# EAGLE design FPGA (EAGLE 9.1.0)
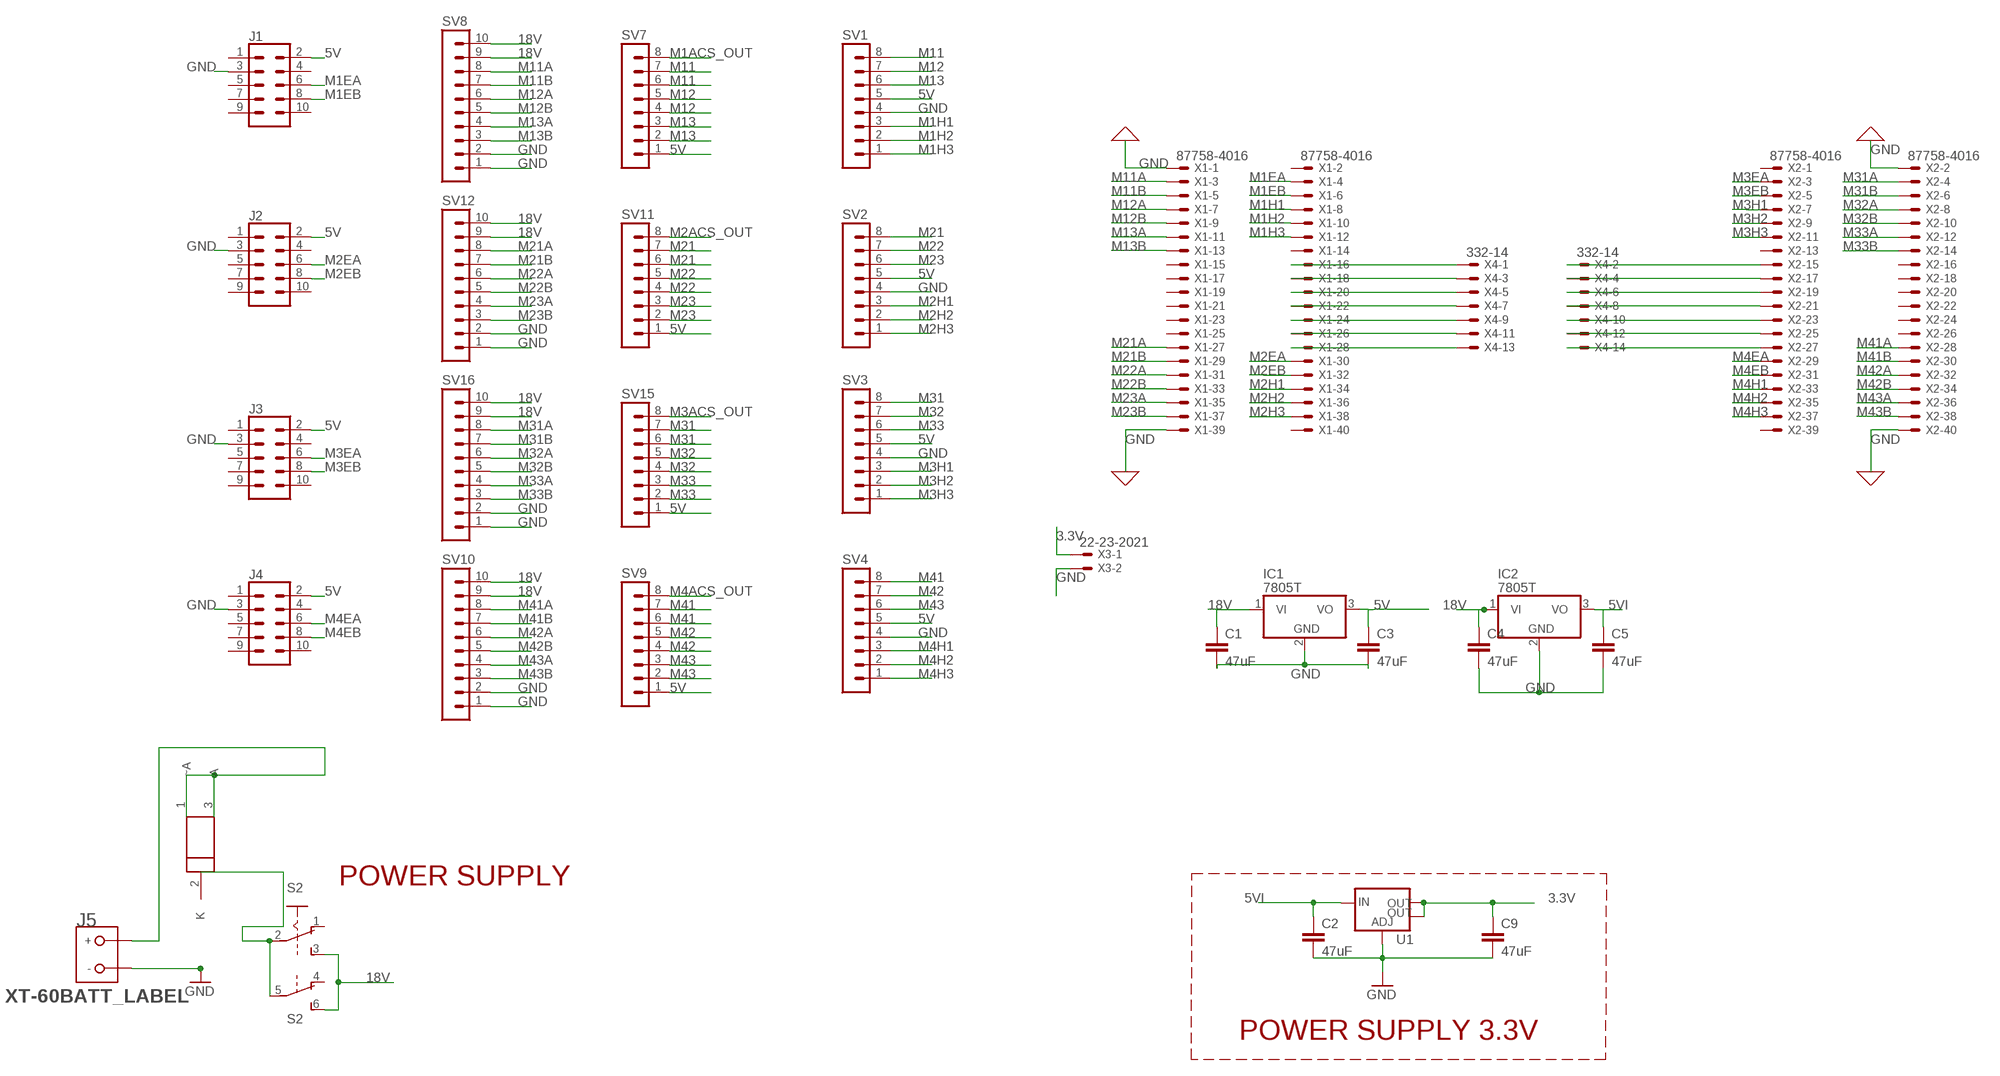
[diagram p0: schematic, sheet 1]

## Parts
C1  47uF  C-EUC1206  [C1206]
C2  47uF  C-EUC1206  [C1206]
C3  47uF  C-EUC1206  [C1206]
C4  47uF  C-EUC1206  [C1206]
C5  47uF  C-EUC1206  [C1206]
C9  47uF  C-EUC1206  [C1206]
IC1  7805T  [TO220H]
IC2  7805T  [TO220H]
J1  CONN_05X2SHD_LOCK  [2X5-SHROUDED_LOCK]
J2  CONN_05X2SHD_LOCK  [2X5-SHROUDED_LOCK]
J3  CONN_05X2SHD_LOCK  [2X5-SHROUDED_LOCK]
J4  CONN_05X2SHD_LOCK  [2X5-SHROUDED_LOCK]
J5  XT-60BATT_LABEL  [XT-60]
S2  A68-A31  [A68-A31]
SV1  MA08-1  [MA08-1]
SV2  MA08-1  [MA08-1]
SV3  MA08-1  [MA08-1]
SV4  MA08-1  [MA08-1]
SV7  MA08-1  [MA08-1]
SV8  MA10-1  [MA10-1]
SV9  MA08-1  [MA08-1]
SV10  MA10-1  [MA10-1]
SV11  MA08-1  [MA08-1]
SV12  MA10-1  [MA10-1]
SV15  MA08-1  [MA08-1]
SV16  MA10-1  [MA10-1]
U1  V_REG_LM1117SOT223  [SOT223]
U3  LP38690DT-3.3  [TO228P1042X238-3N]
X1  87758-4016  [87758-4016]
X2  87758-4016  [87758-4016]
X3  22-23-2021  [22-23-2021]
X4  332-14  [332-14]

## Nets
3.3V [5v]: C9.1 U1.2(OUT) U1.4(OUT) X3.1
5V [5v]: C3.1 IC1.3(VO) J1.2 J2.2 J3.2 J4.2 SV1.5 SV2.5 SV3.5 SV4.5 SV7.1 SV9.1 SV11.1 SV15.1
5VI [5v]: C2.1 C5.1 IC2.3(VO) U1.3(IN)
18V [18V]: C1.1 C4.1 IC1.1(VI) IC2.1(VI) S2.3(A:S) S2.6(B:S) SV8.9 SV8.10 SV10.9 SV10.10 SV12.9 SV12.10 SV16.9 SV16.10
GND [gnd]: C1.2 C2.2 C3.2 C4.2 C5.2 C9.2 IC1.2(GND) IC2.2(GND) J1.3 J2.3 J3.3 J4.3 J5.GND(-) SV1.4 SV2.4 SV3.4 SV4.4 SV8.1 SV8.2 SV10.1 SV10.2 SV12.1 SV12.2 SV16.1 SV16.2 U1.1(ADJ) X1.1 X1.39 X2.2 X2.40 X3.2
INPUT [VCKT]: J5.BATT(+) U3.1(~A) U3.3(A)
M1ACS_OUT: SV7.8
M1EA: J1.6 X1.4
M1EB: J1.8 X1.6
M1H1: SV1.3 X1.8
M1H2: SV1.2 X1.10
M1H3: SV1.1 X1.12
M2ACS_OUT: SV11.8
M2EA: J2.6 X1.30
M2EB: J2.8 X1.32
M2H1: SV2.3 X1.34
M2H2: SV2.2 X1.36
M2H3: SV2.1 X1.38
M3ACS_OUT: SV15.8
M3EA: J3.6 X2.3
M3EB: J3.8 X2.5
M3H1: SV3.3 X2.7
M3H2: SV3.2 X2.9
M3H3: SV3.1 X2.11
M4ACS_OUT: SV9.8
M4EA: J4.6 X2.29
M4EB: J4.8 X2.31
M4H1: SV4.3 X2.33
M4H2: SV4.2 X2.35
M4H3: SV4.1 X2.37
M11: SV1.8 SV7.6 SV7.7
M11A [signal]: SV8.8 X1.3
M11B [signal]: SV8.7 X1.5
M12: SV1.7 SV7.4 SV7.5
M12A: SV8.6 X1.7
M12B: SV8.5 X1.9
M13: SV1.6 SV7.2 SV7.3
M13A: SV8.4 X1.11
M13B: SV8.3 X1.13
M21: SV2.8 SV11.6 SV11.7
M21A: SV12.8 X1.27
M21B: SV12.7 X1.29
M22: SV2.7 SV11.4 SV11.5
M22A: SV12.6 X1.31
M22B: SV12.5 X1.33
M23: SV2.6 SV11.2 SV11.3
M23A: SV12.4 X1.35
M23B: SV12.3 X1.37
M31 [motor]: SV3.8 SV15.6 SV15.7
M31A: SV16.8 X2.4
M31B: SV16.7 X2.6
M32 [motor]: SV3.7 SV15.4 SV15.5
M32A: SV16.6 X2.8
M32B: SV16.5 X2.10
M33 [motor]: SV3.6 SV15.2 SV15.3
M33A: SV16.4 X2.12
M33B: SV16.3 X2.14
M41: SV4.8 SV9.6 SV9.7
M41A: SV10.8 X2.28
M41B: SV10.7 X2.30
M42: SV4.7 SV9.4 SV9.5
M42A: SV10.6 X2.32
M42B: SV10.5 X2.34
M43: SV4.6 SV9.2 SV9.3
M43A: SV10.4 X2.36
M43B: SV10.3 X2.38
N$1: X1.16 X4.1
N$2: X1.18 X4.3
N$3: X1.20 X4.5
N$4: X1.22 X4.7
N$5: X1.24 X4.9
N$6: X1.26 X4.11
N$7: X1.28 X4.13
N$8: X2.27 X4.14
N$9: X2.25 X4.12
N$10: X2.23 X4.10
N$11: X2.21 X4.8
N$12: X2.19 X4.6
N$13: X2.17 X4.4
N$14: X2.15 X4.2
N$25 [default]: S2.2(A:P) S2.5(B:P) U3.2(K)
Unconnected: J1.1 J1.4 J1.5 J1.7 J1.9 J1.10 J2.1 J2.4 J2.5 J2.7 J2.9 J2.10 J3.1 J3.4 J3.5 J3.7 J3.9 J3.10 J4.1 J4.4 J4.5 J4.7 J4.9 J4.10 S2.1(A:O) S2.4(B:O) X1.2 X1.14 X1.15 X1.17 X1.19 X1.21 X1.23 X1.25 X1.40 X2.1 X2.13 X2.16 X2.18 X2.20 X2.22 X2.24 X2.26 X2.39

## Notes on the sheet
- POWER SUPPLY
- POWER SUPPLY 3.3V

## Library data of the parts
C1-C5 C9 = rcl:C-EU: CAPACITOR, European symbol
IC1 IC2 = linear:78*: Positive VOLTAGE REGULATOR Source: http://cache.national.com/ds/LM/LM78L05.pdf http://www.fairchildsemi.com/ds/LM/LM7805.pdf
J1-J4 = SparkFun-Connectors:CONN_05X2: Multi connection point. Often used as Generic Header-pin footprint for 0.1 inch spaced/style header connections For AVR SPI programming port, see special device with nice symbol: "AVR_SPI_PROG_5x2.dev" You can populate with any combo of single row headers, but if you'd like an exact match, check these: 2x5 AVR ICSP Male Header <https://www.sparkfun.com/products/778> (PRT-00778) 2x5 Pin Shrouded Header <https://www.sparkfun.com/products/8506> (PRT-08506) On any of the 0.1 inch spaced packages, you can populate with these: Break Away Headers - Straight <https://www.sparkfun.com/products/116> (PRT-00116) Break Away Male Headers - Right Angle <https://www.sparkfun.com/products/553> (PRT-00553) Female Headers <https://www.sparkfun.com/products/115> (PRT-00115) Break Away Headers - Machine Pin <https://www.sparkfun.com/products/117> (PRT-00117) Break Away Female Headers - Swiss Machine Pin <https://www.sparkfun.com/products/743> (PRT-00743) Special note: the shrouded connector mates well with our 5x2 ribbon cables: 2x5 Pin IDC Ribbon Cable <https://www.sparkfun.com/products/8535> (PRT-08535); PROD_ID: CONN-08671; SF_ID: PRT-08506
J5 = RoboJackets-Connectors:XT-60: XT-60 Power Connector Distributor: HobbyKing <http://www.hobbyking.com/hobbyking/store/RC_PRODUCT_SEARCH.asp?strSearch=xt-60>
S2 = switch:A68-A31: SLIDING SWITCH Siemens, distributor Buerklin, 11G766
SV1-SV4 SV7 SV9 SV11 SV15 = con-lstb:MA08-1: PIN HEADER; OC_FARNELL: unknown; OC_NEWARK: unknown
SV8 SV10 SV12 SV16 = con-lstb:MA10-1: PIN HEADER; OC_FARNELL: unknown; OC_NEWARK: unknown
U1 = SparkFun-PowerIC:V_REG_LM1117: Voltage Regulator LM1117 Standard adjustable voltage regulator but in SMD form. Spark Fun Electronics SKU : COM-00595; PROD_ID: VREG-08170
U3 = LP38690DT-3.3:LP38690DT-3.3; MPN: LP38690DT-3.3; OC_FARNELL: 1008048; OC_NEWARK: 41K7439; PACKAGE: TO-252; SUPPLIER: National Semiconductor
X1 X2 = con-molex:87758-4016: 40 Pin - 2mm Dual Row Single Wafer, Vertical T/H HDR Source: http://www.molex.com/pdm_docs/sd/877580616_sd.pdf; MF: MOLEX; MPN: 87758-4016; OC_FARNELL: unknown; OC_NEWARK: 25M5691
X3 = con-molex:22-23-2021: .100" (2.54mm) Center Header - 2 Pin; MF: MOLEX; MPN: 22-23-2021; OC_FARNELL: 1462926; OC_NEWARK: 25C3832
X4 = con-garry:332-14: 14 Pin - 2mm Dual Row Source: www.mpe-connector.de / garry_shortform_2012.pdf

## Net classes
0 signal1: width 0.3 mm, drill 0.4 mm, clearance 0.2 mm
1 5v: width 0.4 mm, drill 0.4 mm, clearance 0.2 mm
2 18V: width 1.2 mm, drill 1.3 mm, clearance 0.2 mm
3 signal: width 0.3 mm, drill 0.4 mm, clearance 0.2 mm
4 gnd: width 0.3 mm, drill 0.4 mm, clearance 0.2 mm
5 VCKT: width 4 mm, drill 4 mm, clearance 0.2 mm
6 motor: width 0.8 mm, drill 1 mm, clearance 0.2 mm

## Board
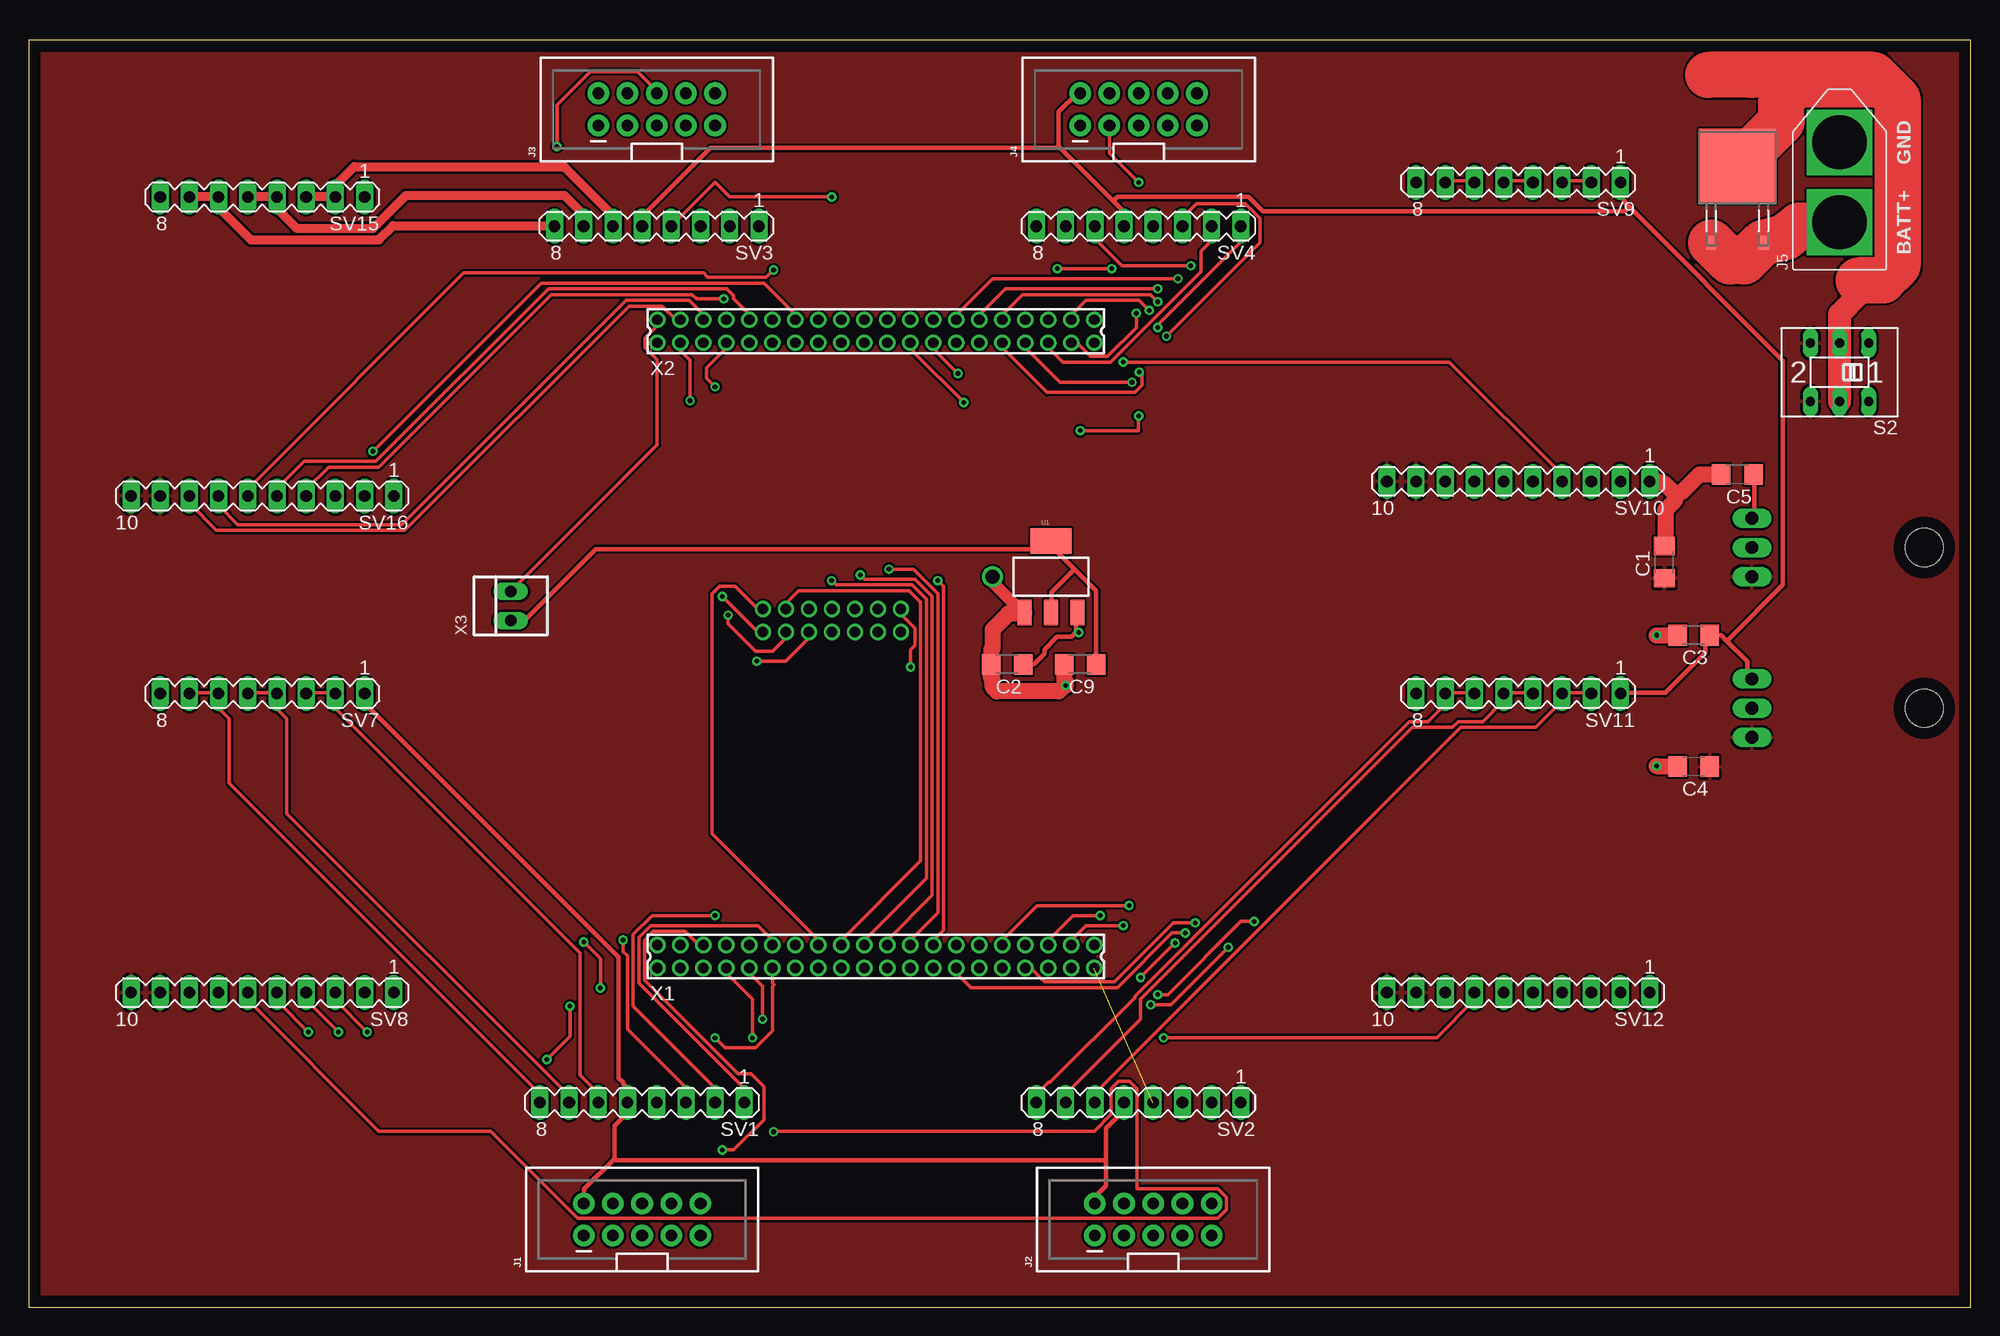
[diagram p1: board, top side]
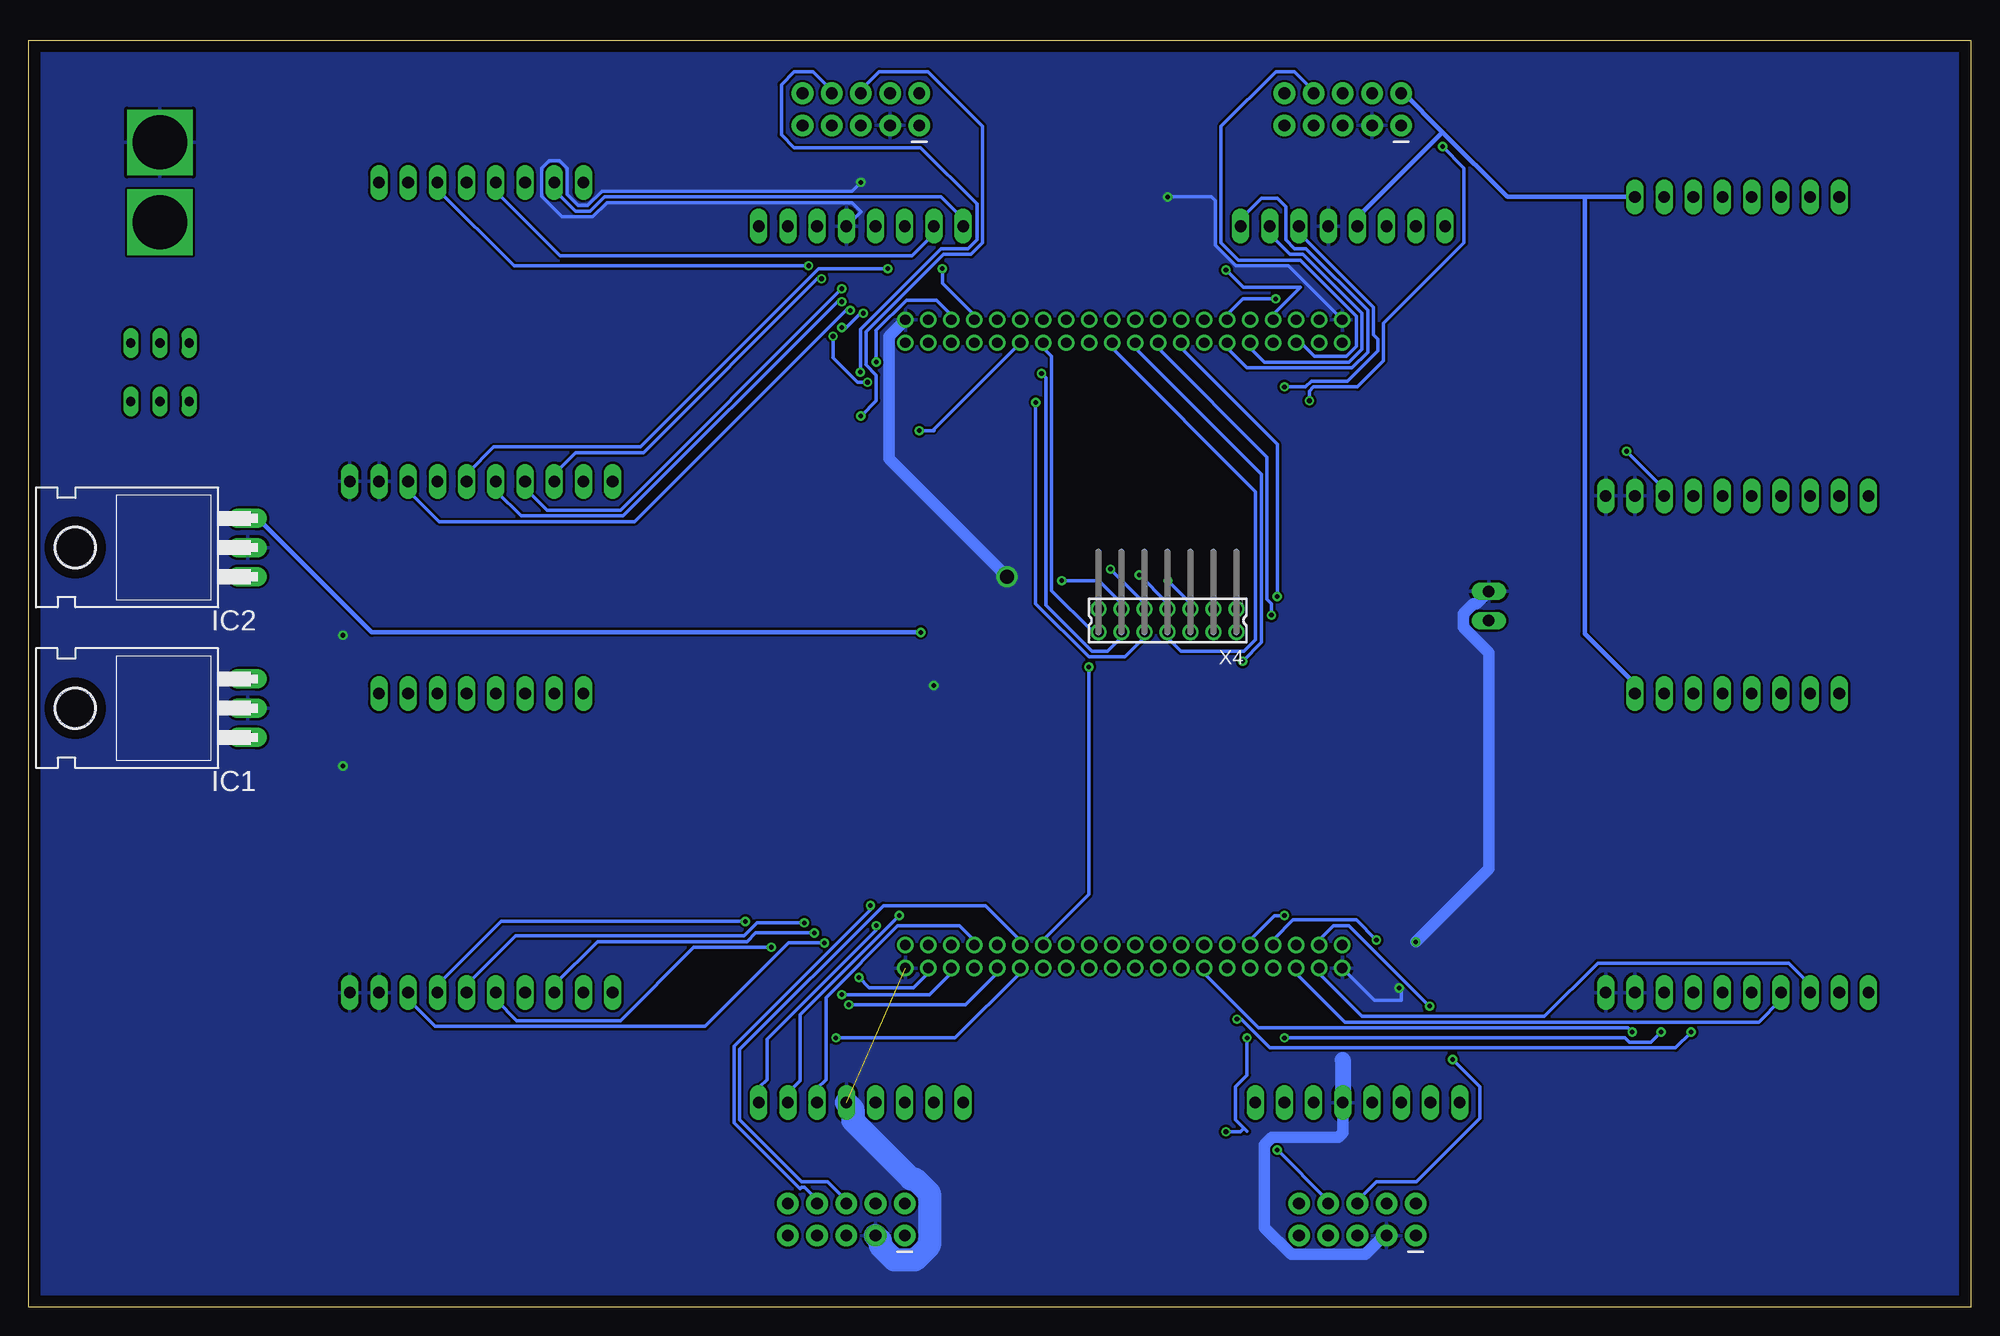
[diagram p2: board, bottom side, seen from below]

Size 168.89 x 110.16 mm. Coordinates in mm from the lower left corner, seen from the top.
Outline: 0,0 168.89,0 168.89,110.16 0,110.16 0,0
Copper layers (1*16): Top 0.035mm / dielectric 1.5mm / Bottom 0.035mm
Design rules "default": minimum track width 6mil, minimum drill 0.35mm, track to track 6mil, track to pad 6mil, pad to pad 6mil, via to via 6mil, smd to smd 6mil, copper to edge 40mil, drill to drill 6mil, minimum pad ring 10mil, minimum via ring 8mil, stop-mask expansion 4mil, vias tented up to drill 0mil, thermal gap 10mil

### Footprints (pad centres in the part's own frame; a part is rotated, then mirrored left to right if it is on the bottom)
C1206 = smd 1.6 x 1.8: 1 -1.4,0; 2 1.4,0
TO220H = drill 1.118 long: 1 -2.54,-10.16; 2 0,-10.16; 3 2.54,-10.16 | hole 3.302: 0,4.826
2X5-SHROUDED_LOCK = drill 1.016 pad 1.88: 1 -1.397,5.08; 2 1.397,5.08; 3 -1.397,2.54; 4 1.397,2.54; 5 -1.397,0; 6 1.397,0; 7 -1.397,-2.54; 8 1.397,-2.54; 9 -1.397,-5.08; 10 1.397,-5.08
XT-60 = drill 4.7 square: BATT 0,4.154; GND 0,11.092
A68-A31 = drill 0.813 long: 1 -2.54,-2.54; 2 0,-2.54; 3 2.54,-2.54; 4 -2.54,2.54; 5 0,2.54; 6 2.54,2.54
MA08-1 = drill 1.016 long: 1 -8.89,0; 2 -6.35,0; 3 -3.81,0; 4 -1.27,0; 5 1.27,0; 6 3.81,0; 7 6.35,0; 8 8.89,0
MA10-1 = drill 1.016 long: 1 -11.43,0; 2 -8.89,0; 3 -6.35,0; 4 -3.81,0; 5 -1.27,0; 6 1.27,0; 7 3.81,0; 8 6.35,0; 9 8.89,0; 10 11.43,0
SOT223 = smd 1.219 x 2.235: 1 -2.311,-3.099; 2 0,-3.099; 3 2.311,-3.099 | smd 3.6 x 2.2: 4 0,3.099
TO228P1042X238-3N = smd 0.889 x 1.219: 1 -2.286,-6.502; 3 2.286,-6.502 | smd 6.731 x 6.502: 2 0,0.152
87758-4016 = drill 0.9 pad 1.27: 1 -19,-1; 2 -19,1; 3 -17,-1; 4 -17,1; 5 -15,-1; 6 -15,1; 7 -13,-1; 8 -13,1; 9 -11,-1; 10 -11,1; 11 -9,-1; 12 -9,1; 13 -7,-1; 14 -7,1; 15 -5,-1; 16 -5,1; 17 -3,-1; 18 -3,1; 19 -1,-1; 20 -1,1; 21 1,-1; 22 1,1; 23 3,-1; 24 3,1; 25 5,-1; 26 5,1; 27 7,-1; 28 7,1; 29 9,-1; 30 9,1; 31 11,-1; 32 11,1; 33 13,-1; 34 13,1; 35 15,-1; 36 15,1; 37 17,-1; 38 17,1; 39 19,-1; 40 19,1
22-23-2021 = drill 1 long: 1 -1.27,0; 2 1.27,0
332-14 = drill 0.9 pad 1.27: 1 -6,-1; 2 -6,1; 3 -4,-1; 4 -4,1; 5 -2,-1; 6 -2,1; 7 0,-1; 8 0,1; 9 2,-1; 10 2,1; 11 4,-1; 12 4,1; 13 6,-1; 14 6,1

### Placement (x,y rotation side)
C1  142.24,64.77 90 top
C2  85.09,55.88 180 top
C3  144.78,58.42 180 top
C4  144.78,46.99 180 top
C5  148.59,72.39 180 top
C9  91.44,55.88 180 top
IC1  160.02,52.07 90 bottom
IC2  160.02,66.04 90 bottom
J1  53.34,7.62 90 top
J2  97.79,7.62 90 top
J3  54.61,104.14 90 top
J4  96.52,104.14 90 top
J5  157.48,90.17 0 top
S2  157.48,81.28 180 top
SV1  53.34,17.78 180 top
SV2  96.52,17.78 180 top
SV3  54.61,93.98 180 top
SV4  96.52,93.98 180 top
SV7  20.32,53.34 180 top
SV8  20.32,27.34 180 top
SV9  129.54,97.79 180 top
SV10  129.54,71.79 180 top
SV11  129.54,53.34 180 top
SV12  129.54,27.34 180 top
SV15  20.32,96.52 180 top
SV16  20.32,70.52 180 top
U1  88.9,63.5 0 top
U3  148.59,99.06 0 top
X1  73.66,30.48 0 top
X2  73.66,84.84 0 top
X3  41.91,60.96 90 top
X4  69.85,59.69 180 bottom

### Tracks (layer width: path | path; a pad name or v marks a point on that pad's centre or on a via)
3.3V
  Top 0.4: 90.94,64.16 88.94,66.16 88.94,66.53 U1.4 88.94,65.91 49.31,65.91 43.19,59.78 41.94,59.78 X3.1 | 90.94,64.16 92.81,62.28 92.81,55.91 C9.1 | U1.2 88.94,60.41 88.94,62.16 90.81,64.03 90.94,64.16
5V
  Top 0.4: 93.69,12.79 93.69,10.54 92.81,9.66 92.81,9.04 J2.2 | 93.69,12.79 93.69,15.54 95.19,17.04 95.19,17.66 SV2.5 | SV7.1 29.32,53.28 29.32,52.41 51.31,30.41 51.31,19.91 51.69,19.54 51.69,19.41 52.06,19.04 SV1.5 51.94,17.66 51.94,16.79 50.94,15.79 50.94,12.91 | 50.94,12.91 48.31,10.29 48.31,9.04 J1.2 | 93.69,12.79 93.56,12.79 51.06,12.79 50.94,12.91 | 147.69,57.91 149.44,56.16 149.44,55.03 149.81,54.66 IC1.3 | 147.69,57.91 147.19,58.41 C3.1 146.06,58.28 145.81,58.03 145.81,56.91 142.31,53.41 138.44,53.41 SV11.1 | 139.19,95.66 152.56,82.28 152.56,62.78 147.81,58.03 147.69,57.91 | 139.19,95.66 138.81,96.03 138.81,96.16 138.44,96.53 SV9.1 | 89.56,100.91 94.31,96.16 | 94.31,96.16 95.19,95.28 95.19,94.03 SV4.5 | 89.56,100.91 89.56,103.91 91.19,105.53 J4.2 | 89.56,100.91 89.44,100.78 59.31,100.78 53.44,94.91 53.44,94.03 SV3.5 | 139.19,95.66 139.06,95.53 138.81,95.28 107.31,95.28 106.06,96.53 94.69,96.53 94.44,96.28 94.31,96.16
  Bottom 0.4: 33.56,96.53 40.31,96.53 45.94,102.16 | 33.56,96.53 29.32,96.53 SV15.1 | 45.94,102.16 49.44,105.66 J3.2 | SV3.5 53.31,94.03 53.31,94.78 46.06,102.03 45.94,102.16 | SV7.1 29.32,53.41 29.32,54.28 33.56,58.53 33.56,96.41 33.56,96.53
5VI  (via drill 0.4)
  Top 0.4: C5.1 150.06,72.28 150.06,68.78 149.94,68.66 IC2.3 | 91.06,58.66 90.69,58.28 89.44,58.28 88.31,57.16 88.31,56.78 87.44,55.91 86.56,55.91 C2.1 | 91.06,58.66 91.06,60.16 91.19,60.28 U1.3 | v91.31,58.66 91.19,58.66 91.06,58.66
  Bottom 0.4: v91.31,58.66 139.06,58.66 148.94,68.53 149.81,68.53 IC2.3
18V
  pour Top (rank 2): -22.86,135.89 -22.86,3.81 0,-19.05 173.99,-19.05 187.96,-5.08 187.96,137.16 182.88,142.24 -16.51,142.24
GND  (via drill 0.4, 1.2)  (1 unrouted)
  Top 0.3: X3.2 54.66,74.98 54.66,82.35 53.61,83.4 53.61,84.28 54.66,85.33 X2.2 | v69.85,96.52 60.96,96.52 59.69,97.79 SV3.4 | v96.52,97.79 93.98,100.33 J4.3 | v49.72,27.75 49.72,30.29 v48.26,31.75
  Top 1: v83.82,63.5 83.82,63.03 86.56,60.28
  Top 1.4: U1.1 86.56,60.28 85.19,60.28 83.81,58.91 83.81,57.28 83.69,57.16 83.69,55.91 C2.2 83.69,55.28 83.69,54.66 83.81,54.53 83.81,53.91 84.19,53.53 89.56,53.53 89.69,53.66 v90.19,54.03 90.19,54.41 90.06,54.53 90.06,55.78 C9.2 | v141.56,47.03 143.31,47.03 C4.2 | v141.56,58.41 143.31,58.41 C3.2 | 143.19,70.66 143.19,70.16 142.31,69.28 142.31,66.28 C1.2 | 143.19,70.66 142.19,71.66 141.81,71.66 141.69,71.78 141.06,71.78 SV10.1 | C5.2 147.19,72.41 145.31,72.41 143.81,70.91 143.19,70.66
  Bottom 0.3: X2.2 59.35,90.53 63.9,90.53 65.69,92.33 65.69,96.17 66.04,96.52 v69.85,96.52 | SV4.4 96.52,95.25 97.3,96.03 118.61,96.03 119.86,94.78 122.52,94.78 124.3,96.57 124.3,99.01 123.65,99.66 122.73,99.66 122.08,99.01 122.08,96.75 121.11,95.78 120.27,95.78 119.02,97.03 97.27,97.03 v96.52,97.79 | X1.1 51.85,26.67 49.53,26.67 49.53,27.56 v49.72,27.75
  Bottom 1: SV1.4 54.61,15.16 55,14.76 60.77,14.76 61.42,14.12 61.42,6.9 59.1,4.58 52.66,4.58 51.02,6.22 J1.3 | X3.2 43,61.14 43.27,61.14 44.12,60.29 44.12,59.09 41.91,56.88 41.91,38.1 v48.26,31.75 | X2.40 92.66,85.83 94.06,84.42 94.06,73.74 v83.82,63.5
  Bottom 1.4: 54.61,21.48 SV1.4
  Bottom 2: SV2.4 97.21,17.2 97.21,16.2 92.16,11.16 91.82,11.16 90.57,9.9 90.57,5.34 91.82,4.08 93.6,4.08 94.85,5.34 94.85,5.82 J2.3
  pour Bottom (rank 2): -16.51,128.27 -16.51,7.62 1.27,-10.16 190.5,-10.16 217.17,16.51 217.17,105.41 190.5,132.08 -12.7,132.08
INPUT
  Top 4: U3.1 146.31,92.53 147.94,90.91 149.19,90.91 150.81,92.53 U3.3 152.81,93.03 153.31,93.53 153.44,93.53 153.94,94.03 157.19,94.03 157.44,94.28 J5.BATT
M1EA  (via drill 0.4)
  Top 0.3: v47.06,26.16 47.06,23.54 v45.06,21.54
  Bottom 0.3: v47.06,26.16 54.06,33.16 55.44,33.16 56.56,32.03 56.56,31.54 X1.4 | v45.06,21.54 42.69,19.16 42.69,16.41 48.19,10.91 51.69,10.91 53.31,9.29 53.31,9.04 J1.6
M1EB  (via drill 0.4)
  Top 0.3: v60.31,13.66 61.31,13.66 63.94,16.29 63.94,19.16 62.81,20.29 61.69,20.29 53.56,28.41 53.56,31.91 54.31,32.66 57.06,32.66 58.19,31.54 58.56,31.54 X1.6
  Bottom 0.3: v60.31,13.66 55.94,9.29 55.94,9.04 J1.8
M1H1  (via drill 0.4)
  Top 0.3: v51.69,31.91 51.69,30.91 52.06,30.54 52.06,24.16 57.06,19.16 57.06,17.79 SV1.3
  Bottom 0.3: v51.69,31.91 53.44,33.66 58.94,33.66 60.56,32.03 60.56,31.54 X1.8
M1H2  (via drill 0.4)
  Top 0.3: v59.69,34.03 54.19,34.03 52.56,32.41 52.56,26.16 59.69,19.04 SV1.2
  Bottom 0.3: v59.69,34.03 60.56,34.03 62.56,32.03 62.56,31.54 X1.10
M1H3
  Top 0.3: X1.12 64.56,31.54 64.56,32.03 63.44,33.16 54.06,33.16 53.06,32.16 53.06,28.16 62.19,19.04 62.19,17.79 SV1.1
M2EA
  Bottom 0.3: X1.30 82.69,31.54 82.69,31.91 85.69,34.91 94.56,34.91 107.06,22.41 107.06,16.29 101.69,10.91 99.44,10.91 97.81,9.29 97.81,9.04 J2.6
M2EB  (via drill 0.4)
  Top 0.3: v95.69,34.91 87.69,34.91 84.69,31.91 84.69,31.54 X1.32
  Bottom 0.3: v95.69,34.91 95.69,34.53 107.56,22.66 107.56,16.04 101.81,10.29 101.69,10.41 101.44,10.41 100.44,9.41 100.44,9.04 J2.8
M2H1
  Bottom 0.3: X1.34 86.69,31.54 86.69,31.91 87.94,33.16 93.31,33.16 99.56,26.91 99.56,19.79 100.31,19.04 100.31,17.79 SV2.3
M2H2  (via drill 0.4)
  Top 0.3: v93.19,34.03 90.81,34.03 88.69,31.91 88.69,31.54 X1.36
  Bottom 0.3: v93.19,34.03 101.81,25.41 101.81,19.66 102.81,18.66 102.81,17.79 SV2.2
M2H3  (via drill 0.4)
  Top 0.3: v95.19,33.16 91.94,33.16 90.69,31.91 90.69,31.54 X1.38
  Bottom 0.3: v95.19,33.16 95.19,32.78 104.69,23.29 104.69,19.79 105.31,19.16 105.31,17.79 SV2.1
M3EA  (via drill 0.4)
  Top 0.3: v45.94,100.91 45.94,104.53 48.81,107.41 52.94,107.41 54.69,105.66 J3.6 | X2.3 56.56,83.78 56.56,83.28 57.52,82.33 v57.52,78.8
  Bottom 0.3: v45.94,100.91 44.06,99.03 44.06,92.53 51.06,85.53 51.06,82.28 53.34,80.01 57.15,80.01 57.52,79.64 v57.52,78.8
M3EB
  Bottom 0.3: X2.5 58.56,83.78 58.19,83.78 57.06,82.66 54.31,82.66 53.44,83.53 53.44,86.16 58.31,91.03 63.69,91.03 65.19,92.53 65.19,102.66 60.44,107.41 58.81,107.41 57.06,105.66 J3.8
M3H1  (via drill 0.4)
  Top 0.3: X2.7 60.56,83.78 60.56,83.28 58.94,81.66 58.94,80.76 v59.69,80.01
  Bottom 0.3: SV3.3 58.31,93.91 58.31,93.28 51.94,86.91 51.94,84.53 51.56,84.16 51.56,83.16 54.21,80.51 57.36,80.51 57.86,80.01 v59.69,80.01
M3H2
  Bottom 0.3: X2.9 62.56,83.78 62.56,83.28 61.44,82.16 54.06,82.16 52.94,83.28 52.94,86.41 58.06,91.53 59.19,91.53 60.94,93.28 60.94,93.91 SV3.2
M3H3
  Bottom 0.3: X2.11 64.56,83.78 64.56,83.28 62.94,81.66 53.81,81.66 52.44,83.03 52.44,86.66 57.81,92.03 58.81,92.03 59.56,92.78 59.56,95.66 60.31,96.41 61.69,96.41 63.44,94.66 63.44,94.03 SV3.1
M4EA  (via drill 0.4)
  Top 0.3: v91.44,76.2 96.52,76.2 v96.52,77.47
  Bottom 0.3: 82.69,83.41 82.69,83.78 X2.29 90.17,76.33 90.17,76.2 v91.44,76.2 | J4.6 96.44,105.66 96.44,105.91 94.94,107.41 90.69,107.41 85.94,102.66 85.94,92.53 86.94,91.53 89.31,91.53 96.06,84.78 96.06,81.91 95.19,81.03 95.19,78.8 v96.52,77.47
M4EB  (via drill 0.4)
  Top 0.3: v96.56,81.28 96.81,81.03 96.81,80.16 96.19,79.53 88.56,79.53 84.69,83.41 84.69,83.78 X2.31
  Bottom 0.3: v96.56,81.28 96.56,85.03 89.56,92.03 87.19,92.03 86.44,92.78 86.44,95.91 91.31,100.78 102.31,100.78 103.44,101.91 103.44,106.28 102.31,107.41 100.69,107.41 98.94,105.66 J4.8
M4H1  (via drill 0.4)
  Top 0.3: v95.94,80.41 89.69,80.41 86.69,83.41 86.69,83.78 X2.33 | v98.94,84.41 107.06,92.53 107.06,94.66 105.81,95.91 101.56,95.91 100.44,94.78 100.44,94.03 SV4.3
  Bottom 0.3: v95.94,80.41 96.81,80.41 98.94,82.53 v98.94,84.41
M4H2
  Top 0.3: X2.35 88.69,83.78 88.69,83.41 89.94,82.16 94.06,82.16 101.94,90.03 101.94,91.78 102.81,92.66 102.81,93.91 SV4.2
M4H3  (via drill 0.4)
  Top 0.3: v96.31,86.41 96.31,85.16 93.81,82.66 92.31,82.66 91.19,83.78 90.69,83.78 X2.37 | v98.19,85.16 98.19,85.41 105.31,92.53 105.31,93.91 SV4.1
  Bottom 0.3: v96.31,86.41 96.56,86.41 97.81,85.16 v98.19,85.16
M11
  Top 0.3: SV1.8 44.44,18.54 17.44,45.53 17.44,51.16 16.57,52.03 16.57,53.28 SV7.6 16.44,53.41 14.06,53.41 SV7.7
M11A
  Bottom 0.3: X1.3 56.56,29.41 56.56,28.91 52.94,25.29 37.06,25.29 32.44,29.91 15.81,29.91 14.06,28.16 14.06,27.41 SV8.8
M11B
  Bottom 0.3: X1.5 58.56,29.41 58.56,28.91 54.44,24.79 18.44,24.79 16.57,26.66 16.57,27.29 SV8.7
M12
  Top 0.3: SV1.7 46.94,17.79 46.94,18.41 22.44,42.91 22.44,51.16 21.69,51.91 21.69,53.28 SV7.4 21.57,53.41 19.07,53.41 SV7.5
M12A  (via drill 0.4)
  Top 0.3: v62.94,23.41 62.94,26.79 60.69,29.04 60.69,29.41 X1.7 | SV8.6 19.07,27.29 19.07,26.66 30.44,15.29 40.17,15.29 47.73,7.73 103.4,7.73 104.16,8.48 104.16,9.55 103.4,10.31 96.36,10.31 96.36,19 95.71,19.65 94.79,19.65 94.14,19 94.14,16.76 92.66,15.29 64.72,15.29 v64.77,15.24
  Bottom 0.3: v62.94,23.41 62.94,20.16 63.94,19.16 63.94,16.29 63.2,15.54 | 62.94,15.29 63.2,15.54 | v64.77,15.24 63.5,15.24 63.2,15.54
M12B  (via drill 0.4)
  Top 0.3: v63.81,25.04 63.81,27.91 62.69,29.04 62.69,29.41 X1.9 | v24.32,23.91 21.69,26.54 21.69,27.29 SV8.5
  Bottom 0.3: v63.81,25.04 63.44,25.04 60.94,22.54 25.69,22.54 v24.32,23.91
M13
  Top 0.3: SV1.6 49.44,17.79 49.44,18.66 47.94,20.16 47.94,30.79 26.69,52.03 26.69,53.28 SV7.2 26.57,53.41 24.19,53.41 SV7.3
M13A  (via drill 0.4)
  Top 0.3: v59.69,23.41 60.56,22.54 63.19,22.54 64.69,24.04 64.69,27.91 64.81,28.04 64.69,28.16 64.69,29.41 X1.11 | v26.94,23.91 24.19,26.66 24.19,27.29 SV8.4
  Bottom 0.3: v59.69,23.41 30.07,23.41 29.69,23.04 27.82,23.04 v26.94,23.91
M13B  (via drill 0.4)
  Top 0.3: v29.44,23.91 26.69,26.66 26.69,27.29 SV8.3
  Bottom 0.3: v29.44,23.91 29.82,24.29 61.94,24.29 66.56,28.91 66.56,29.41 X1.13
M21
  Top 0.3: SV2.8 87.69,17.79 87.69,18.54 88.69,19.54 88.81,19.54 96.19,26.91 96.19,27.04 120.06,50.91 121.69,50.91 123.19,52.41 123.19,53.28 SV11.7 123.31,53.41 125.69,53.41 SV11.6
M21A  (via drill 0.4)
  Top 0.3: v100.56,32.53 99.44,32.53 94.69,27.79 81.94,27.79 80.69,29.04 80.69,29.41 X1.27
  Bottom 0.3: v100.56,32.53 105.69,32.53 106.44,31.79 119.44,31.79 123.19,28.04 123.19,27.41 SV12.8
M21B  (via drill 0.4)
  Top 0.3: v98.69,23.41 122.44,23.41 125.69,26.66 125.69,27.29 SV12.7
  Bottom 0.3: v98.69,23.41 88.31,23.41 82.69,29.04 82.69,29.41 X1.29
M22
  Top 0.3: SV2.7 90.19,17.79 90.19,18.54 96.69,25.04 96.69,26.79 120.31,50.41 123.81,50.41 124.31,50.91 126.44,50.91 128.19,52.66 128.19,53.28 SV11.5 128.31,53.41 130.69,53.41 SV11.4
M22A  (via drill 0.4)
  Top 0.3: v97.56,26.29 99.31,26.29 v104.31,31.29
  Bottom 0.3: v97.56,26.29 87.44,26.29 84.69,29.04 84.69,29.41 X1.31 | v104.31,31.29 111.06,31.29 117.44,24.91 126.44,24.91 128.19,26.66 128.19,27.29 SV12.6
M22B  (via drill 0.4)
  Top 0.3: v101.44,33.41 99.56,33.41 94.44,28.29 88.31,28.29 87.19,29.41 86.69,29.41 X1.33
  Bottom 0.3: v101.44,33.41 105.56,33.41 106.69,32.28 126.56,32.28 130.69,28.16 130.69,27.41 SV12.5
M23
  Top 0.3: SV2.6 92.81,17.79 92.81,18.66 124.56,50.41 131.06,50.41 133.31,52.66 133.31,53.28 SV11.3 133.44,53.41 135.81,53.41 SV11.2
M23A  (via drill 0.4)
  Top 0.3: v98.19,27.16 99.06,27.16 105.44,33.53 v106.56,33.53
  Bottom 0.3: v98.19,27.16 90.56,27.16 88.69,29.04 88.69,29.41 X1.35 | v106.56,33.53 127.81,33.53 133.31,28.04 133.31,27.41 SV12.4
M23B  (via drill 0.4)
  Top 0.3: v99.69,31.66 v96.69,28.66
  Bottom 0.3: v96.69,28.66 95.81,27.79 91.94,27.79 90.69,29.04 90.69,29.41 X1.37 | v99.69,31.66 102.81,31.66 110.06,24.41 133.56,24.41 135.81,26.66 135.81,27.29 SV12.3
M31
  Top 0.8: SV15.7 14.06,96.53 16.44,96.53 SV15.6 16.57,96.16 16.57,95.53 19.32,92.78 30.44,92.78 31.69,94.03 45.69,94.03 SV3.8
M31A
  Top 0.3: X2.4 56.56,85.91 56.19,85.91 55.06,87.03 52.19,87.03 32.69,67.53 16.32,67.53 14.06,69.78 14.06,70.41 SV16.8
M31B
  Top 0.3: X2.6 58.56,85.91 58.56,86.41 57.44,87.53 51.94,87.53 32.44,68.03 18.19,68.03 16.57,69.66 16.57,70.41 SV16.7
M32
  Top 0.8: SV15.5 19.07,96.53 21.57,96.53 SV15.4 21.69,96.16 21.69,95.41 23.32,93.78 29.94,93.78 32.81,96.66 46.56,96.66 48.19,95.03 48.19,94.03 SV3.7
M32A  (via drill 0.4)
  Top 0.3: SV16.6 19.07,70.53 19.07,71.16 37.81,89.91 58.68,89.91 59.05,89.53 64.13,89.53 v64.77,90.17
  Bottom 0.3: X2.8 60.56,85.91 60.56,86.41 58.31,88.66 63.26,88.66 v64.77,90.17
M32B
  Top 0.3: X2.10 62.56,85.91 62.56,86.41 61.31,87.66 61.31,87.91 60.69,88.53 58.42,88.53 45.19,88.53 30.19,73.53 23.94,73.53 21.69,71.28 21.69,70.53 SV16.5
M33
  Top 0.8: SV15.3 24.19,96.53 26.57,96.53 SV15.2 26.69,96.91 26.69,97.53 28.32,99.16 46.56,99.16 50.69,95.03 50.69,94.03 SV3.6
M33A  (via drill 0.4)
  Top 0.3: v60.44,87.66 58.06,87.66 57.69,88.03 45.44,88.03 30.44,73.03 26.07,73.03 24.19,71.16 24.19,70.53 SV16.4
  Bottom 0.3: v60.44,87.66 63.31,87.66 64.56,86.41 64.56,85.91 X2.12
M33B  (via drill 0.4)
  Top 0.3: v29.94,74.41 44.56,89.03 63.94,89.03 66.56,86.41 66.56,85.91 X2.14
  Bottom 0.3: v29.94,74.41 26.69,71.16 26.69,70.53 SV16.3
M41
  Top 0.3: SV9.6 125.69,97.91 123.19,97.91 SV9.7
  Bottom 0.3: SV4.8 87.69,94.03 87.69,94.66 89.56,96.53 118.81,96.53 120.06,95.28 121.31,95.28 123.19,97.16 SV9.7
M41A  (via drill 0.4)
  Top 0.3: v99.94,89.41 83.81,89.41 80.69,86.28 80.69,85.91 X2.28
  Bottom 0.3: v99.94,89.41 100.31,89.41 115.44,74.28 121.31,74.28 123.19,72.41 123.19,71.91 SV10.8
M41B  (via drill 0.4)
  Top 0.3: v98.19,88.53 84.94,88.53 82.69,86.28 82.69,85.91 X2.30
  Bottom 0.3: v98.19,88.53 117.44,69.28 123.81,69.28 125.69,71.16 125.69,71.78 SV10.7
M42
  Top 0.3: SV9.4 130.69,97.91 128.31,97.91 SV9.5
  Bottom 0.3: SV4.7 90.19,93.91 90.19,93.28 92.06,91.41 122.69,91.41 128.19,96.91 128.19,97.78 SV9.5
M42A  (via drill 0.4)
  Top 0.3: v98.19,87.41 97.56,88.03 86.44,88.03 84.69,86.28 84.69,85.91 X2.32
  Bottom 0.3: v98.19,87.41 98.56,87.41 117.19,68.78 126.06,68.78 128.19,70.91 128.19,71.78 SV10.6
M42B  (via drill 0.4)
  Top 0.3: v94.19,90.28 v89.44,90.28
  Bottom 0.3: v89.44,90.28 89.44,89.03 86.69,86.28 86.69,85.91 X2.34 | v94.19,90.28 100.19,90.28 115.69,74.78 128.44,74.78 130.69,72.53 130.69,71.91 SV10.5
M43  (via drill 0.4)
  Top 0.3: v101.06,90.53 95.06,90.53 92.81,92.78 92.81,93.91 SV4.6 | SV9.2 135.81,97.91 133.44,97.91 SV9.3
  Bottom 0.3: v101.06,90.53 126.69,90.53 133.31,97.16 133.31,97.78 SV9.3
M43A  (via drill 0.4)
  Top 0.3: v95.19,82.16 123.56,82.16 133.31,72.41 133.31,71.91 SV10.4
  Bottom 0.3: v95.19,82.16 95.19,84.91 92.56,87.53 89.94,87.53 88.69,86.28 88.69,85.91 X2.36
M43B  (via drill 0.4)
  Top 0.3: v97.44,86.66 96.56,87.53 91.94,87.53 90.69,86.28 90.69,85.91 X2.38
  Bottom 0.3: v97.44,86.66 97.81,86.66 116.19,68.28 133.19,68.28 135.81,70.91 135.81,71.78 SV10.3
N$1
  Top 0.3: X1.16 68.56,31.54 68.56,32.03 59.44,41.16 59.44,62.03 60.06,62.66 61.44,62.66 63.31,60.78 63.81,60.78 X4.1
N$2
  Top 0.3: X1.18 70.69,31.54 70.69,31.91 77.56,38.78 77.56,61.28 76.56,62.28 66.94,62.28 65.94,61.28 65.94,60.78 X4.3
N$3  (via drill 0.4)
  Top 0.3: v69.81,63.16 70.19,62.78 76.81,62.78 78.06,61.53 78.06,37.28 72.69,31.91 72.69,31.54 X1.20
  Bottom 0.3: v69.81,63.16 67.94,61.28 67.94,60.78 X4.5
N$4  (via drill 0.4)
  Top 0.3: v72.31,63.66 72.69,63.28 77.06,63.28 78.56,61.78 78.56,35.78 74.69,31.91 74.69,31.54 X1.22
  Bottom 0.3: v72.31,63.66 69.94,61.28 69.94,60.78 X4.7
N$5  (via drill 0.4)
  Top 0.3: v74.81,64.16 76.94,64.16 79.06,62.03 79.06,34.28 76.69,31.91 76.69,31.54 X1.24
  Bottom 0.3: v74.81,64.16 71.94,61.28 71.94,60.78 X4.9
N$6  (via drill 0.4)
  Top 0.3: v79.06,63.16 79.56,62.66 79.56,32.78 78.69,31.91 78.69,31.54 X1.26
  Bottom 0.3: v79.06,63.16 75.81,63.16 73.94,61.28 73.94,60.78 X4.11
N$7  (via drill 0.4)
  Top 0.3: v76.69,55.66 76.69,57.16 77.06,57.53 77.06,59.03 75.94,60.16 75.94,60.66 X4.13
  Bottom 0.3: v76.69,55.66 76.69,35.91 80.56,32.03 80.56,31.54 X1.28
N$8
  Bottom 0.3: X4.14 75.94,58.78 76.44,58.78 79.94,62.28 79.94,82.66 80.56,83.28 80.56,83.78 X2.27
N$9  (via drill 0.4)
  Top 0.3: v80.81,81.16 78.94,83.03 78.94,83.16 78.69,83.41 78.69,83.78 X2.25
  Bottom 0.3: v80.81,81.16 80.44,80.78 80.44,61.03 76.44,57.03 75.06,57.03 73.94,58.16 73.94,58.66 X4.12
N$10  (via drill 0.4)
  Top 0.3: v81.31,78.66 76.94,83.03 76.94,83.16 76.69,83.41 76.69,83.78 X2.23
  Bottom 0.3: v81.31,78.66 81.31,61.16 76.69,56.53 73.56,56.53 71.94,58.16 71.94,58.66 X4.10
N$11
  Bottom 0.3: X4.8 69.81,58.66 69.81,58.16 68.69,57.03 63.19,57.03 62.19,58.03 62.19,70.91 74.56,83.28 74.56,83.78 X2.21
N$12  (via drill 0.4)
  Top 0.3: v63.31,56.16 65.81,56.16 67.81,58.16 67.81,58.66 X4.6
  Bottom 0.3: v63.31,56.16 61.69,57.78 61.69,72.41 72.56,83.28 72.56,83.78 X2.19
N$13  (via drill 0.4)
  Top 0.3: v60.81,60.16 60.81,59.41 63.19,57.03 64.69,57.03 65.81,58.16 65.81,58.66 X4.4
  Bottom 0.3: v60.81,60.16 60.81,61.16 61.19,61.53 61.19,73.91 70.56,83.28 70.56,83.78 X2.17
N$14  (via drill 0.4)
  Top 0.3: v60.31,61.78 63.31,58.78 63.81,58.78 X4.2
  Bottom 0.3: v60.31,61.78 60.31,75.03 68.56,83.28 68.56,83.78 X2.15
N$25
  Top 2: 159.12,89.27 159.12,88 157.48,86.36 157.48,85.09 | S2.5 157.48,85.09 | S2.2 157.48,85.09
  Top 4: 161.25,106.32 153.71,106.32 152.42,105.03 152.42,103.04 U3.2 | 161.25,106.32 162.54,105.03 | 162.54,90.55 161.25,89.27 | 162.54,105.03 162.54,90.55 | 161.25,89.27 159.12,89.27 | 161.25,89.27 162.54,90.55 | 162.54,105.03 161.25,106.32 | 162.54,90.55 162.54,105.03 | 159.12,89.27 161.25,89.27 | 161.25,106.32 160.43,107.14 | 160.43,107.14 146.05,107.14 | 159.12,89.27 161.25,89.27 | 161.25,89.27 162.54,90.55 | 162.54,105.03 161.25,106.32 | 162.54,90.55 162.54,105.03 | 161.25,106.32 160.43,107.14 | 160.43,107.14 149.86,107.14